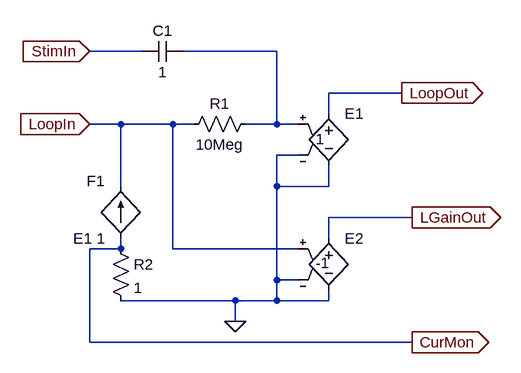
[diagram p0: schematic LoopGainProbe.asc]
LoopGainProbe.asc, the LTspice schematic file:
Version 4
SHEET 1 880 680
WIRE 336 112 336 80
WIRE 336 80 448 80
WIRE 336 304 336 272
WIRE 336 272 464 272
WIRE -32 128 16 128
WIRE 208 128 256 128
WIRE -32 16 48 16
WIRE 256 16 256 128
WIRE 256 128 288 128
WIRE 336 384 336 400
WIRE 336 400 256 400
WIRE 192 432 192 400
WIRE 192 400 16 400
WIRE 256 400 256 368
WIRE 256 400 192 400
WIRE 256 368 288 368
WIRE 256 368 256 224
WIRE 256 176 288 176
WIRE 336 192 336 224
WIRE 336 224 256 224
WIRE 256 224 256 176
WIRE 96 128 96 320
WIRE 96 128 128 128
WIRE 96 320 288 320
WIRE 16 224 16 128
WIRE 16 128 96 128
WIRE 112 16 256 16
WIRE 16 320 16 304
WIRE 16 320 -32 320
WIRE -32 320 -32 464
WIRE -32 464 464 464
FLAG -32 128 LoopIn
IOPIN -32 128 In
FLAG 448 80 LoopOut
IOPIN 448 80 Out
FLAG -32 16 StimIn
IOPIN -32 16 In
FLAG 464 272 LGainOut
IOPIN 464 272 Out
FLAG 192 432 0
FLAG 464 464 CurMon
IOPIN 464 464 Out
SYMBOL e 336 96 R0
WINDOW 3 -20 55 Left 0
SYMATTR Value 1
SYMATTR InstName E1
SYMBOL e 336 288 R0
WINDOW 3 -20 54 Left 0
SYMATTR Value -1
SYMATTR InstName E2
SYMBOL res 224 112 R90
WINDOW 0 0 56 VBottom 0
WINDOW 3 32 56 VTop 0
SYMATTR InstName R1
SYMATTR Value 10Meg
SYMBOL f 16 304 R180
WINDOW 0 24 88 Left 0
WINDOW 3 24 0 Left 0
SYMATTR InstName F1
SYMATTR Value E1 1
SYMBOL cap 112 0 R90
WINDOW 0 0 32 VBottom 0
WINDOW 3 32 32 VTop 0
SYMATTR InstName C1
SYMATTR Value 1
SYMBOL res 0 304 R0
SYMATTR InstName R2
SYMATTR Value 1

The netlist it stands for:
* LoopGainProbe.asc
E1 LoopOut 0 N001 0 1
E2 LGainOut 0 LoopIn 0 -1
R1 N001 LoopIn 10Meg
F1 CurMon LoopIn E1 1
C1 N001 StimIn 1
R2 CurMon 0 1
.backanno
.end